# EAGLE design Communications Board (EAGLE 6.6.0)

## Sheet 1 of 3
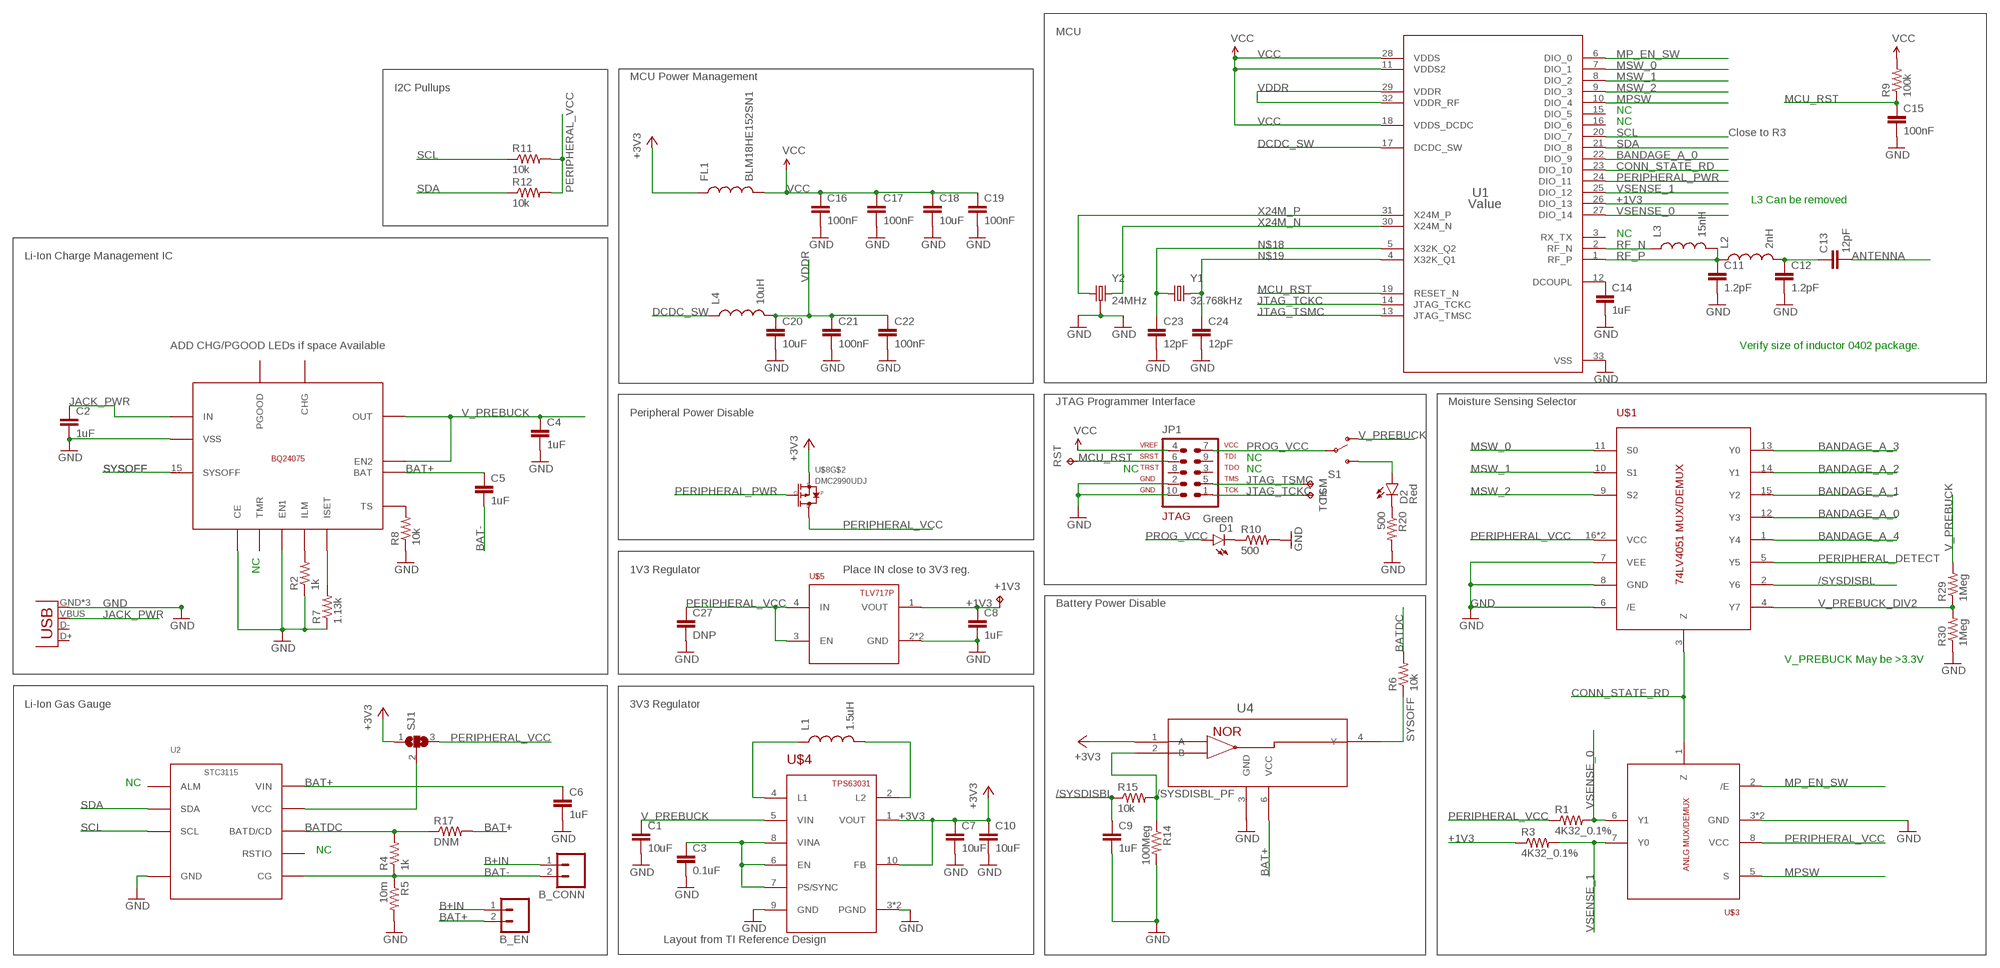
[diagram p0: schematic, sheet 1]

### Parts
+1V3  TPTP10R  [TP10R]
B_CONN  M02PTH  [1X02]
B_EN  M02PTH  [1X02]
C1  10uF  CAP0402-CAP  [0402-CAP]
C2  1uF  CAP0603-CAP  [0603-CAP]
C3  0.1uF  CAP0402-CAP  [0402-CAP]
C4  1uF  CAP0603-CAP  [0603-CAP]
C5  1uF  CAP0603-CAP  [0603-CAP]
C6  1uF  CAP0603-CAP  [0603-CAP]
C7  10uF  CAP0402-CAP  [0402-CAP]
C8  1uF  CAP0402-CAP  [0402-CAP]
C9  1uF  CAP0603-CAP  [0603-CAP]
C10  10uF  CAP0603-CAP  [0603-CAP]
C11  1.2pF  CAP0402-CAP  [0402-CAP]
C12  1.2pF  CAP0402-CAP  [0402-CAP]
C13  12pF  CAP0402-CAP  [0402-CAP]
C14  1uF  CAP0402-CAP  [0402-CAP]
C15  100nF  CAP0402-CAP  [0402-CAP]
C16  100nF  CAP0402-CAP  [0402-CAP]
C17  100nF  CAP0402-CAP  [0402-CAP]
C18  10uF  CAP0402-CAP  [0402-CAP]
C19  100nF  CAP0402-CAP  [0402-CAP]
C20  10uF  CAP0402-CAP  [0402-CAP]
C21  100nF  CAP0402-CAP  [0402-CAP]
C22  100nF  CAP0402-CAP  [0402-CAP]
C23  12pF  CAP0402-CAP  [0402-CAP]
C24  12pF  CAP0402-CAP  [0402-CAP]
C27  DNP  CAP0402-CAP  [0402-CAP]
D1  Green  LED1206  [LED-1206]
D2  Red  LED1206  [LED-1206]
FL1  BLM18HE152SN1  INDUCTOR0603  [0603]
JP1  AVR-JTAG-10  [AVR-JTAG-10]
L1  1.5uH  INDUCTOR  [IND1212]
L2  2nH  INDUCTOR0402  [C0402]
L3  15nH  INDUCTOR0402  [C0402]
L4  10uH  INDUCTOR0603  [0603]
R1  4K32_0.1%  RESISTOR0402-RES  [0402-RES]
R2  1k  RESISTOR0603-RES  [0603-RES]
R3  4K32_0.1%  RESISTOR0402-RES  [0402-RES]
R4  1k  RESISTOR0603-RES  [0603-RES]
R5  10m  RESISTOR0603-RES  [0603-RES]
R6  10k  RESISTOR0603-RES  [0603-RES]
R7  1.13k  RESISTOR0603-RES  [0603-RES]
R8  10k  RESISTOR0603-RES  [0603-RES]
R9  100k  RESISTOR0603-RES  [0603-RES]
R10  500  RESISTOR0603-RES  [0603-RES]
R11  10k  RESISTOR0603-RES  [0603-RES]
R12  10k  RESISTOR0603-RES  [0603-RES]
R14  100Meg  RESISTOR0603-RES  [0603-RES]
R15  10k  RESISTOR0603-RES  [0603-RES]
R17  DNM  RESISTOR0603-RES  [0603-RES]
R20  500  RESISTOR0603-RES  [0603-RES]
R29  1Meg  RESISTOR0402-RES  [0402-RES]
R30  1Meg  RESISTOR0402-RES  [0402-RES]
RST  TPTP10R  [TP10R]
S1  SWITCH-SPDT  [JS102011SAQN]
SJ1  SJ2W  [SJ_2]
TCK  TPTP10R  [TP10R]
TSM  TPTP10R  [TP10R]
U1  Value  CC2640F128RHBR  [RHB0032E]
U2  STC3115  [DFN10-2X3]
U4  SN74AUP1G02_DSF_6  [DSF6]
U$1  74LV4051  [SOT763-1]
U$2  BQ24075  [QFN16-3X3MM]
U$3  74LVC2G53  [SOT833-1]
U$4  TPS63031  [SON-10]
U$5  TLV717P  [X2SON]
U$8  DMC2990UDJ  [SOT963]
X2  USB-MICROB  [USB-MICROB]
Y1  32.768kHz  CRYSTAL  [CRYSTAL-3.2X1.5]
Y2  24MHz  CRYSTAL-GROUNDED  [TSX-3225]

### Nets
+1V3: +1V3.TP C8.1 R3.1 U1.26(DIO_13) U$5.1(VOUT)
+3V3: C7.1 C10.1 FL1.1 SJ1.1 U4.1(A) U$4.1(VOUT) U$4.10(FB) U$8.4(S) ; also sheet 2,3
/SYSDISBL: C9.1 R15.1 U$1.2(Y6) ; also sheet 3
/SYSDISBL_PF: R14.1 R15.2 U4.2(B)
ANTENNA: C13.2
B+IN: B_CONN.1 B_EN.1
BANDAGE_A_0: U1.22(DIO_9) U$1.12(Y3) ; also sheet 3
BANDAGE_A_1: U$1.15(Y2) ; also sheet 3
BANDAGE_A_2: U$1.14(Y1) ; also sheet 3
BANDAGE_A_3: U$1.13(Y0) ; also sheet 3
BANDAGE_A_4: U$1.1(Y4) ; also sheet 3
BAT+: B_EN.2 C5.1 C6.1 R17.2 U2.P10(VIN) U4.6(VCC) U$2.2(BAT) U$2.3(BAT)
BAT-: B_CONN.2 C5.2 R4.1 R5.1 U2.P6(CG)
BATDC: R4.2 R6.2 R17.1 U2.P8(BATD/CD)
CONN_STATE_RD: U1.23(DIO_10) U$1.3(Z) U$3.1(Z)
DCDC_SW: L4.1 U1.17(DCDC_SW)
GND: C1.2 C2.2 C3.2 C4.2 C6.2 C7.2 C8.2 C9.2 C10.2 C11.2 C12.2 C14.2 C15.2 C16.2 C17.2 C18.2 C19.2 C20.2 C21.2 C22.2 C23.2 C24.2 C27.2 JP1.2 JP1.10 R2.1 R5.2 R7.1 R8.1 R10.2 R14.2 R20.2 R30.1 U1.33(VSS) U2.P5(GND) U4.3(GND) U$1.6(/E) U$1.7(VEE) U$1.8(GND) U$2.4(CE) U$2.6(EN1) U$2.8(VSS) U$2.EXT(VSS) U$3.3(GND) U$3.4(GND) U$4.3(PGND) U$4.9(GND) U$4.PAD(PGND) U$5.2(GND) U$5.PAD(GND) X2.GND X2.MT1(GND) X2.MT2(GND) Y2.2 Y2.4 ; also sheet 2,3
JACK_PWR: C2.1 U$2.13(IN) X2.VBUS
JTAG_TCKC: JP1.1 TCK.TP U1.14(JTAG_TCKC)
JTAG_TSMC: JP1.5 TSM.TP U1.13(JTAG_TMSC)
MCU_RST: C15.1 JP1.6 R9.1 RST.TP U1.19(RESET_N)
MP_EN_SW: U1.6(DIO_0) U$3.2(/E)
MPSW: U1.10(DIO_4) U$3.5(S)
MSW_0: U1.7(DIO_1) U$1.11(S0)
MSW_1: U1.8(DIO_2) U$1.10(S1)
MSW_2: U1.9(DIO_3) U$1.9(S2)
N$5: L1.P$1 U$4.4(L1)
N$6: D2.A S1.3(S)
N$8: L1.P$2 U$4.2(L2)
N$10: C3.1 U$4.6(EN) U$4.7(PS/SYNC) U$4.8(VINA)
N$16: D2.C R20.1
N$18: C23.1 U1.5(X32K_Q2) Y1.1
N$19: C24.1 U1.4(X32K_Q1) Y1.2
N$20: R8.2 U$2.1(TS)
N$23: R2.2 U$2.12(ILM)
N$24: R7.2 U$2.16(ISET)
N$26: SJ1.2 U2.P9(VCC)
N$27: D1.C R10.1
N$41: C12.1 C13.1 L2.2
N$43: C14.1 U1.12(DCOUPL)
PERIPHERAL_DETECT: U$1.5(Y5) ; also sheet 3
PERIPHERAL_PWR: U1.24(DIO_11) U$8.5(G)
PERIPHERAL_VCC: C27.1 R1.1 R11.2 R12.2 SJ1.3 U$1.16(VCC) U$1.PAD(VCC) U$3.8(VCC) U$5.3(EN) U$5.4(IN) U$8.3(D) ; also sheet 3
PROG_VCC: D1.A JP1.7 S1.2(P)
RF_N: L3.1 U1.2(RF_N)
RF_P: C11.1 L2.1 L3.2 U1.1(RF_P)
SCL: R11.1 U1.20(DIO_7) U2.P3(SCL) ; also sheet 2,3
SDA: R12.1 U1.21(DIO_8) U2.P2(SDA) ; also sheet 2,3
SYSOFF: R6.1 U4.4(Y) U$2.15(SYSOFF)
V_PREBUCK: C1.1 C4.1 R29.2 S1.1(O) U$2.5(EN2) U$2.10(OUT) U$2.11(OUT) U$4.5(VIN) ; also sheet 3
V_PREBUCK_DIV2: R29.1 R30.2 U$1.4(Y7)
VCC: C16.1 C17.1 C18.1 C19.1 FL1.2 JP1.4 R9.2 U1.11(VDDS2) U1.18(VDDS_DCDC) U1.28(VDDS) ; also sheet 2
VDDR: C20.1 C21.1 C22.1 L4.2 U1.29(VDDR) U1.32(VDDR_RF)
VSENSE_0: R1.2 U1.27(DIO_14) U$3.6(Y1)
VSENSE_1: R3.2 U1.25(DIO_12) U$3.7(Y0)
X24M_N: U1.30(X24M_N) Y2.3
X24M_P: U1.31(X24M_P) Y2.1
Unconnected: JP1.3 JP1.8 JP1.9 U1.3(RX_TX) U1.15(DIO_5) U1.16(DIO_6) U2.P1(ALM) U2.P7(RSTIO) U$2.7(PGOOD) U$2.9(CHG) U$2.14(TMR) U$8.1(S) U$8.2(G) U$8.6(D) X2.D+ X2.D-

### Notes on the sheet
- MCU
- MCU Power Management
- I2C Pullups
- NC
- NC
- Close to R3
- L3 Can be removed
- NC
- Li-Ion Charge Management IC
- ADD CHG/PGOOD LEDs if space Available | Verify size of inductor 0402 package.
- JTAG Programmer Interface | Moisture Sensing Selector
- Peripheral Power Disable
- NC
- NC | NC
- NC | 1V3 Regulator | Place IN close to 3V3 reg.
- Battery Power Disable
- V_PREBUCK May be >3.3V
- Li-Ion Gas Gauge | 3V3 Regulator
- NC
- NC
- Layout from TI Reference Design

## Sheet 2 of 3
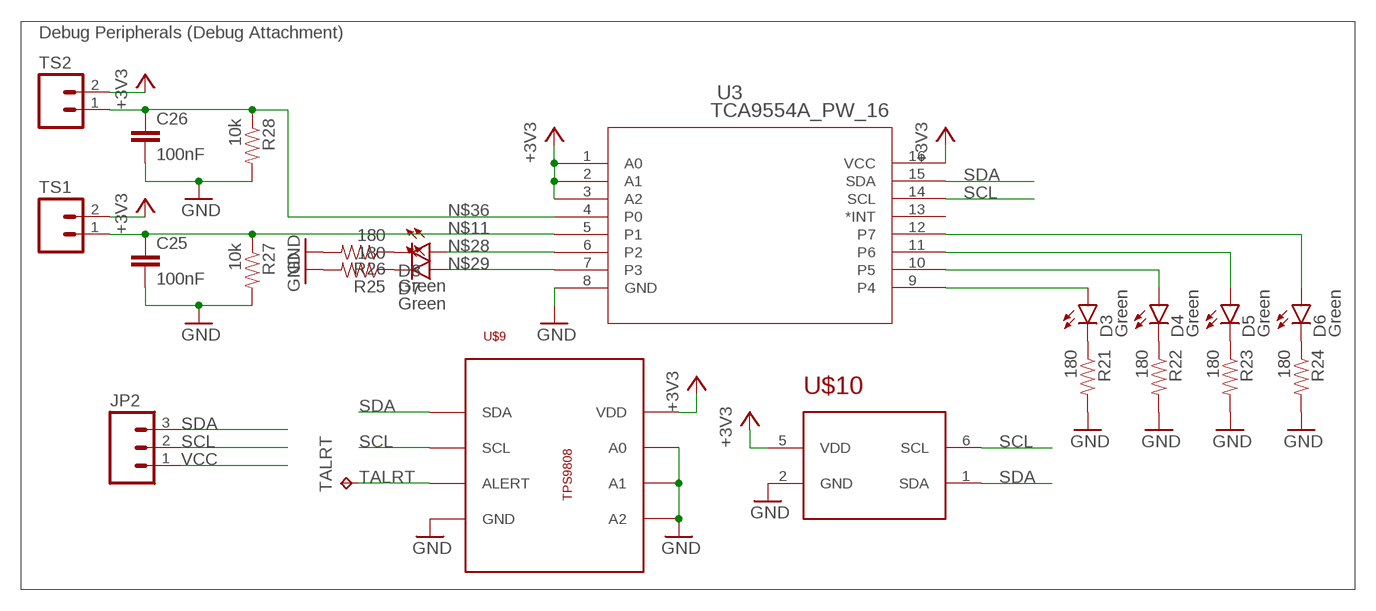
[diagram p1: schematic, sheet 2]

### Parts
C25  100nF  CAP0402-CAP  [0402-CAP]
C26  100nF  CAP0402-CAP  [0402-CAP]
D3  Green  LED1206  [LED-1206]
D4  Green  LED1206  [LED-1206]
D5  Green  LED1206  [LED-1206]
D6  Green  LED1206  [LED-1206]
D7  Green  LED1206  [LED-1206]
D8  Green  LED1206  [LED-1206]
JP2  M03PTH  [1X03]
R21  180  RESISTOR0603-RES  [0603-RES]
R22  180  RESISTOR0603-RES  [0603-RES]
R23  180  RESISTOR0603-RES  [0603-RES]
R24  180  RESISTOR0603-RES  [0603-RES]
R25  180  RESISTOR0603-RES  [0603-RES]
R26  180  RESISTOR0603-RES  [0603-RES]
R27  10k  RESISTOR0603-RES  [0603-RES]
R28  10k  RESISTOR0603-RES  [0603-RES]
TALRT  TPTP17R  [TP17R]
TS1  M02PTH  [1X02]
TS2  M02PTH  [1X02]
U3  TCA9554A_PW_16  [PW16]
U$9  MCP9808  [MSOP8]
U$10  HDC1050  [SON-6]

### Nets
+3V3: TS1.2 TS2.2 U3.1(A0) U3.2(A1) U3.3(A2) U3.16(VCC) U$9.8(VDD) U$10.5(VDD) ; also sheet 1,3
GND: C25.2 C26.2 R21.2 R22.2 R23.2 R24.2 R25.2 R26.2 R27.2 R28.2 U3.8(GND) U$9.4(GND) U$9.5(A2) U$9.6(A1) U$9.7(A0) U$10.2(GND) ; also sheet 1,3
N$7: D3.A U3.9(P4)
N$11: C25.1 R27.1 TS1.1 U3.5(P1)
N$13: D4.A U3.10(P5)
N$15: D5.A U3.11(P6)
N$17: D6.A U3.12(P7)
N$28: D8.A U3.6(P2)
N$29: D7.A U3.7(P3)
N$30: D3.C R21.1
N$31: D4.C R22.1
N$32: D5.C R23.1
N$33: D6.C R24.1
N$34: D7.C R25.1
N$35: D8.C R26.1
N$36: C26.1 R28.1 TS2.1 U3.4(P0)
SCL: JP2.2 U3.14(SCL) U$9.2(SCL) U$10.6(SCL) ; also sheet 1,3
SDA: JP2.3 U3.15(SDA) U$9.1(SDA) U$10.1(SDA) ; also sheet 1,3
TALRT: TALRT.TP U$9.3(ALERT)
VCC: JP2.1 ; also sheet 1
Unconnected: U3.13(*INT)

### Notes on the sheet
- Debug Peripherals (Debug Attachment)

## Sheet 3 of 3
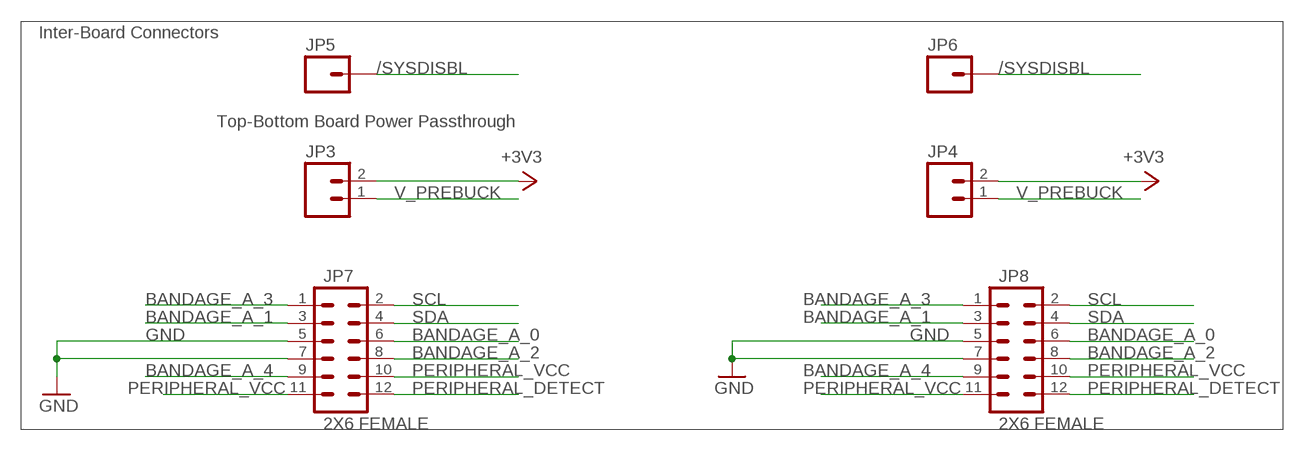
[diagram p2: schematic, sheet 3]

### Parts
JP3  M021X02_NO_SILK  [1X02_NO_SILK]
JP4  M021X02_NO_SILK  [1X02_NO_SILK]
JP5  M01PTH  [1X01]
JP6  M01PTH  [1X01]
JP7  2X6 FEMALE  M06X2PTH_FEMALE  [2X6]
JP8  2X6 FEMALE  M06X2PTH_FEMALE  [2X6]

### Nets
+3V3: JP3.2 JP4.2 ; also sheet 1,2
/SYSDISBL: JP5.1 JP6.1 ; also sheet 1
BANDAGE_A_0: JP7.6 JP8.6 ; also sheet 1
BANDAGE_A_1: JP7.3 JP8.3 ; also sheet 1
BANDAGE_A_2: JP7.8 JP8.8 ; also sheet 1
BANDAGE_A_3: JP7.1 JP8.1 ; also sheet 1
BANDAGE_A_4: JP7.9 JP8.9 ; also sheet 1
GND: JP7.5 JP7.7 JP8.5 JP8.7 ; also sheet 1,2
PERIPHERAL_DETECT: JP7.12 JP8.12 ; also sheet 1
PERIPHERAL_VCC: JP7.10 JP7.11 JP8.10 JP8.11 ; also sheet 1
SCL: JP7.2 JP8.2 ; also sheet 1,2
SDA: JP7.4 JP8.4 ; also sheet 1,2
V_PREBUCK: JP3.1 JP4.1 ; also sheet 1

### Notes on the sheet
- Inter-Board Connectors
- Top-Bottom Board Power Passthrough

## Library data of the parts
+1V3 RST TALRT TCK TSM = testpad:TP: Test pad
B_CONN B_EN JP3 JP4 TS1 TS2 = SparkFun-Connectors:M02: Standard 2-pin 0.1" header. Use with - straight break away headers ( PRT-00116) - right angle break away headers (PRT-00553) - swiss pins (PRT-00743) - machine pins (PRT-00117) - female headers (PRT-00115) Molex polarized connector foot print use with: PRT-08233 with associated crimp pins and housings. 2.54_SCREWTERM for use with PRT-10571. 3.5mm Screw Terminal footprints for PRT-08084 5mm Screw Terminal footprints for use with PRT-08432
C1 C3 C7-C27 = SparkFun-Passives:CAP: Capacitor Standard 0603 ceramic capacitor, and 0.1" leaded capacitor.
C2 C4-C6 = SparkFun:CAP: Capacitor Standard 0603 ceramic capacitor, and 0.1" leaded capacitor.
D1-D8 = SparkFun-LED:LED: LEDs Standard schematic elements and footprints for 5mm, 3mm, 1206, and 0603 sized LEDs. 5mm - Spark Fun Electronics SKU : COM-00529 (and others)
FL1 L4 = Michael Blouin Library:INDUCTOR: Inductors
JP1 = avr-7:AVR-JTAG-10: AVR JTAG Debug/Programming Header
JP2 = SparkFun-Connectors:M03: Header 3 Standard 3-pin 0.1" header. Use with straight break away headers (SKU : PRT-00116), right angle break away headers (PRT-00553), swiss pins (PRT-00743), machine pins (PRT-00117), and female headers (PRT-00115). Molex polarized connector foot print use with SKU : PRT-08232 with associated crimp pins and housings.
JP5 JP6 = SparkFun-Connectors:M01: Header 1 Standard 1-pin 0.1" header. Use with straight break away headers (SKU : PRT-00116), right angle break away headers (PRT-00553), swiss pins (PRT-00743), machine pins (PRT-00117), and female headers (PRT-00115).
JP7 JP8 = SparkFun-Connectors:M06X2; PROD_ID: CONN-12423
L1 = Capstone Library:INDUCTOR: Inductors
L2 L3 = SparkFun-Passives:INDUCTOR: Inductors
R1-R12 R14 R15 R17 R20-R30 = SparkFun-Passives:RESISTOR: Resistor Basic schematic elements and footprints for 0603, 1206, and PTH resistors.
S1 = Capstone Library:SWITCH-SPDT: SPDT Switch Simple slide switch for C&K Components JS102011SAQN DIGIKEY PN: 401-1999-2-ND Symbol from Sparkfun Libs
SJ1 = jumper:SJ2W: SMD solder JUMPER
U1 = Capstone Library:CC2640F128RHBR; ALTERNATEPARTNUMBER: CC2640F128RHBT; COMPTYPE: IC; MANUFACTURER: Texas Instruments; MOUNTTYPE: SMT; PACKAGEREFERENCE: RHB0032E; PARTNUMBER: CC2640F128RHBR; PIN_COUNT: 33; REFDES: RefDes; ROHS: Y; TYPE: TYPE
U2 = Michael Blouin Library:STC3115: STC3115 Li-Ion Gas gauge IC with alarm output for handheld applications
U3 = Capstone Library:TCA9554A_PW_16; DATASHEETURL: http://www.ti.com/lit/gpn/TCA9554A; DESCRIPTION: Remote 8-Bit I2C and SMBus I/O Expander; FAMILY_NAME: I2C IO EXPANDER; GENERIC_PART_NUMBER: TCA9554A; INDUSTRY_STD_PKG_TYPE: TSSOP; MANUFACTURER: Texas Instruments; MANUFACTURER_PART_NUMBER: tca9554a_pw_16; PACKAGE_DESIGNATOR: PW; PIN_COUNT: 16; VENDOR: Texas Instruments
U4 = Capstone Library:SN74AUP1G02_DSF_6; DATASHEETURL: http://www.ti.com/lit/gpn/SN74AUP1G02; DESCRIPTION: Low-Power Single 2-Input Positive-NOR Gate; FAMILY_NAME: LL NOR GATE; GENERIC_PART_NUMBER: SN74AUP1G02; INDUSTRY_STD_PKG_TYPE: SON; MANUFACTURER: Texas Instruments; MANUFACTURER_PART_NUMBER: sn74aup1g02_dsf_6; PACKAGE_DESIGNATOR: DSF; PIN_COUNT: 6; VENDOR: Texas Instruments
U$1 = Capstone Library:74LV4051
U$2 = CM Module Library:BQ24075
U$3 = Capstone Library:74LVC2G53
U$4 = Capstone Library:TPS63031
U$5 = Capstone Library:TLV717P
U$8 = Capstone Library:DMC2990UDJ: Diodes Incorporated DMC2990UDJ Complementary Pair Enhancement Mode MOSFET
U$9 = Capstone Library:MCP9808: MCP9808 Maximum Accuracy Digital Temperature Sensor
U$10 = Capstone Library:HDC1050
X2 = Capstone Library:USB: USB Connectors USB-B-PTH is fully proven SKU : PRT-00139 USB-miniB is fully proven SKU : PRT-00587 USB-A-PCB is untested. USB-A-H is throughly reviewed, but untested. Spark Fun Electronics SKU : PRT-00437 USB-B-SMT is throughly reviewed, but untested. Needs silkscreen touching up. USB-A-S has not been used/tested USB-MB-H has not been used/tested
Y1 = Capstone Library:CRYSTAL
Y2 = Capstone Library:CRYSTAL-GROUNDED

## Board
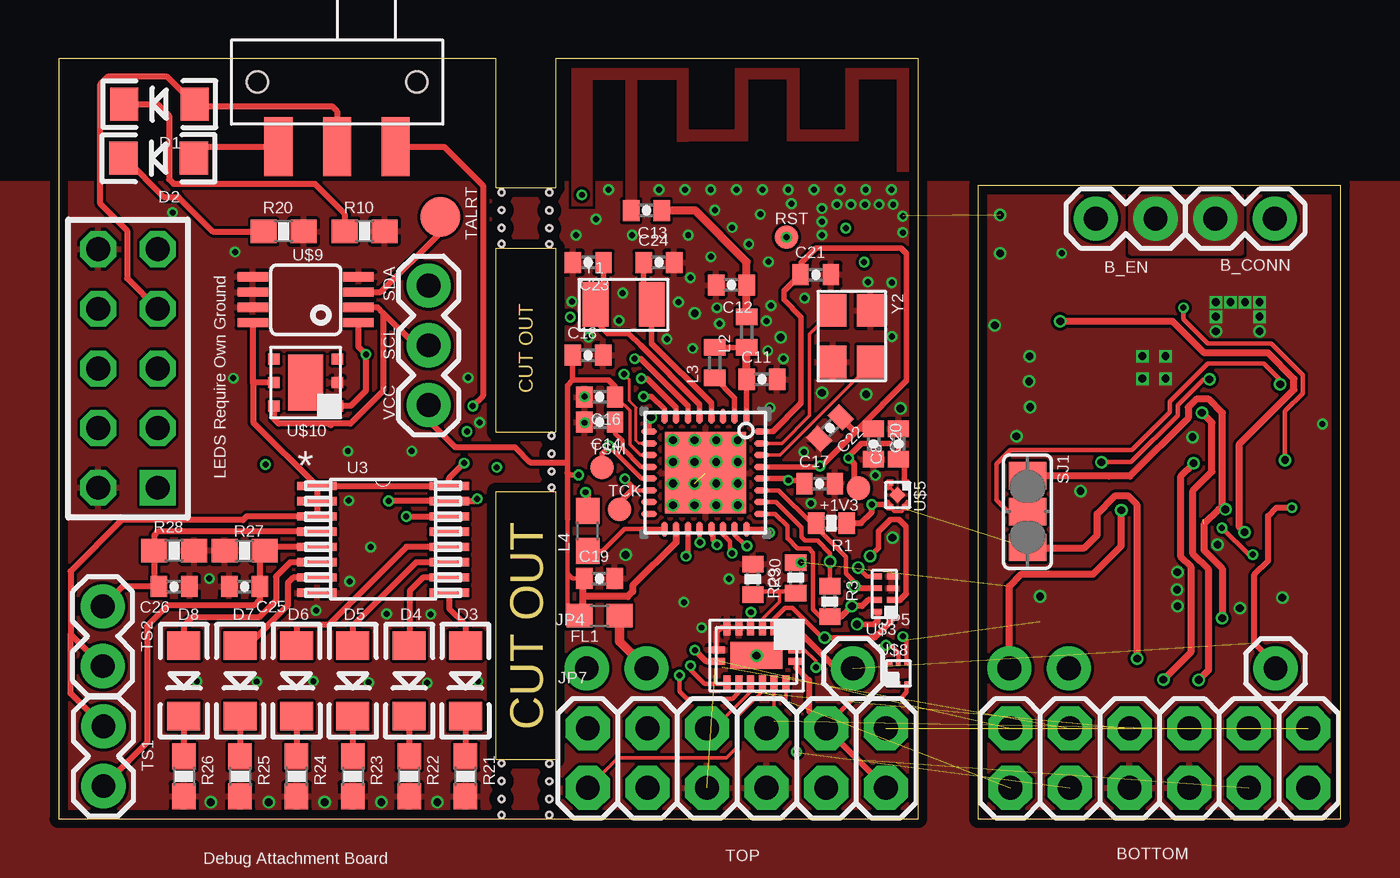
[diagram p3: board, top side]
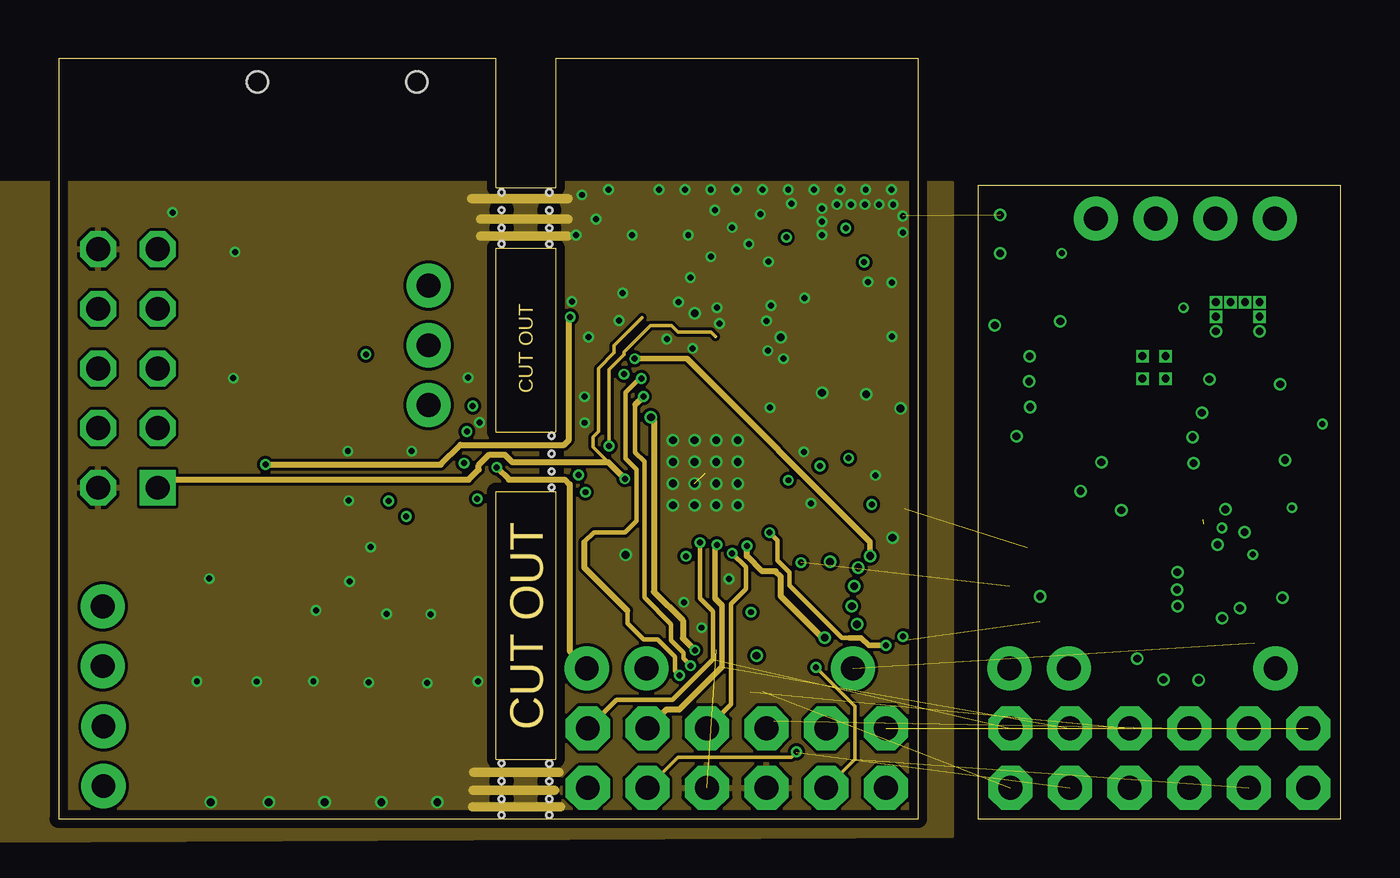
[diagram p4: board, inner layer Route2]
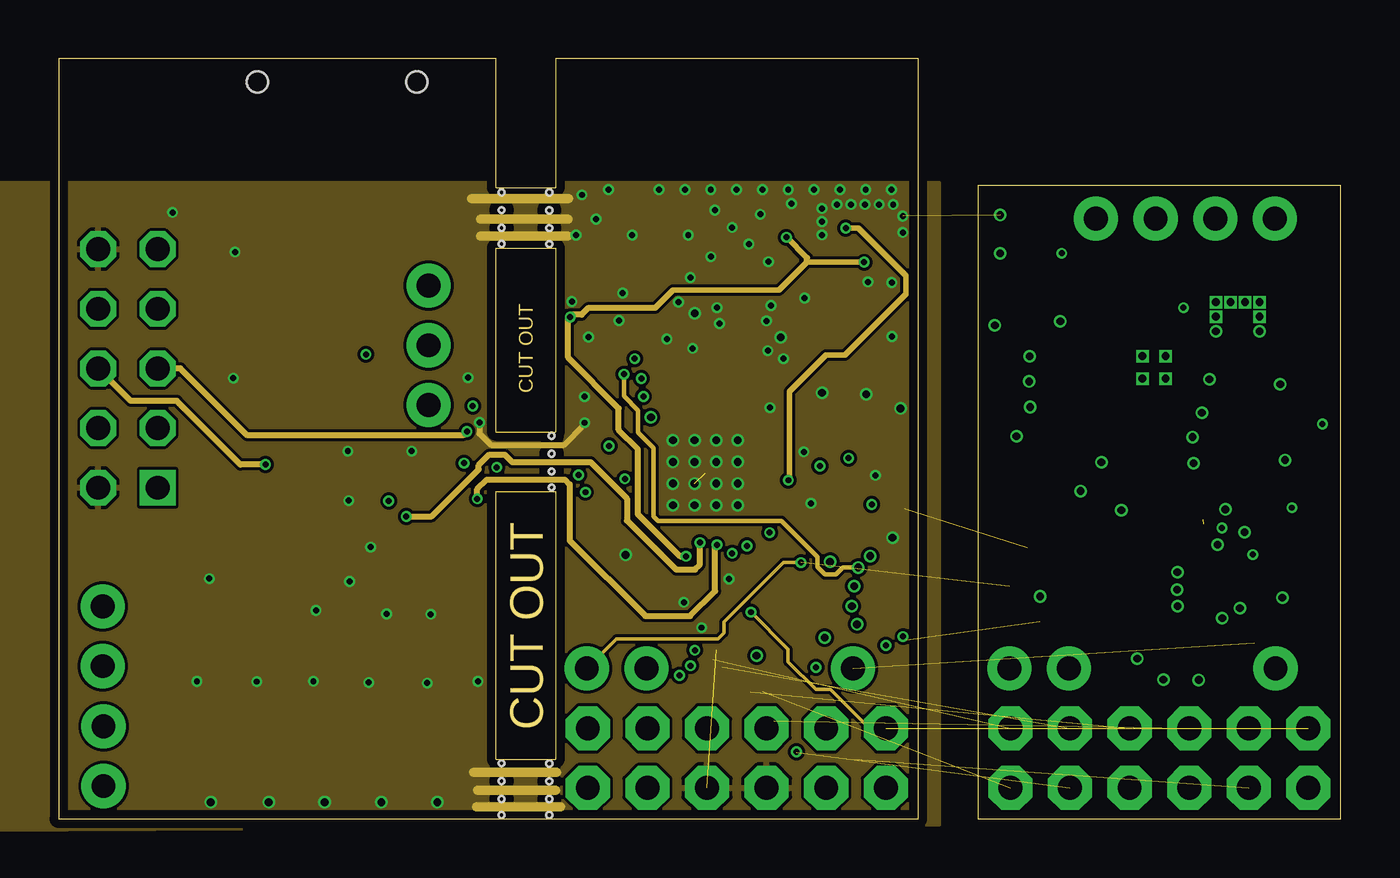
[diagram p5: board, inner layer Route15]
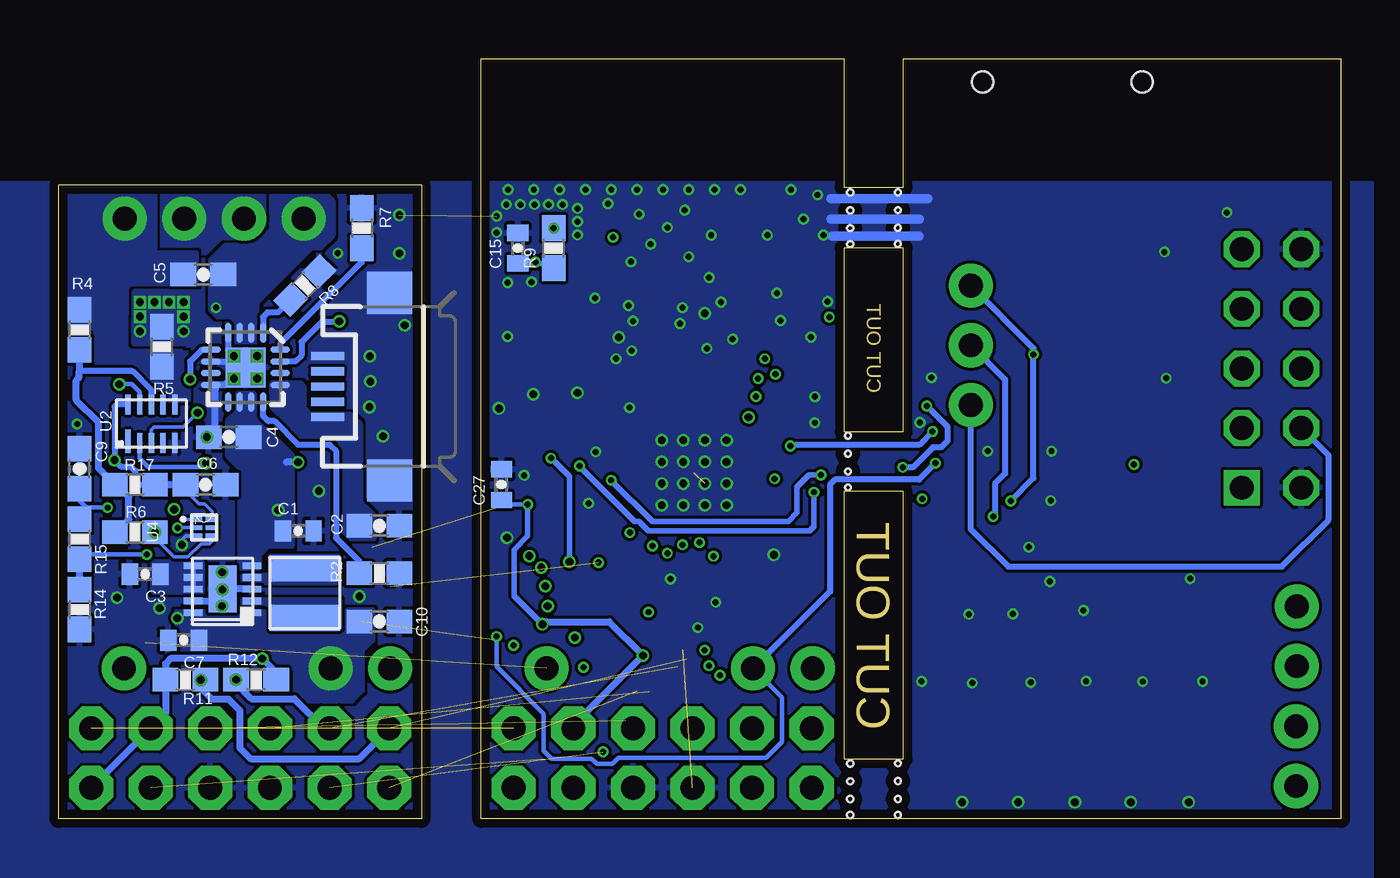
[diagram p6: board, bottom side, seen from below]

Size 54.62 x 32.39 mm. Coordinates in mm from the lower left corner, seen from the top.
Outline: 36.62,0 36.62,32.39 21.17,32.39 21.17,26.9 18.63,26.9 18.63,32.39 0,32.39 0,0 36.62,0
Outline: 21.17,24.33 21.17,16.49 18.63,16.49 18.63,24.33 21.17,24.33
Outline: 21.17,13.95 21.17,2.54 18.63,2.54 18.63,13.95 21.17,13.95
Outline: 39.17,0 54.62,0 54.62,27 39.17,27 39.17,0
Copper layers (1*2*15*16): Top 0.035559375mm / dielectric 0.17018125mm / Route2 0.01778125mm / dielectric 47mil / Route15 0.01778125mm / dielectric 0.17018125mm / Bottom 0.035559375mm
Design rules "OSH Park 4 Layer *": minimum track width 5mil, minimum drill 10mil, track to track 5mil, track to pad 6mil, pad to pad 6mil, via to via 6mil, smd to smd 0mil, copper to edge 15mil, drill to drill 8mil, minimum pad ring 6mil, minimum via ring 4mil, stop-mask expansion 4mil, vias tented up to drill 100mil, thermal gap 6mil
Holes 0.25 mm at 21,16.32 21,15.56 21,14.8 21,14.12 20.9,2.36 20.9,1.6 20.9,0.84 20.9,0.16 18.87,2.37 18.87,1.61 18.87,0.85 18.87,0.17 20.9,26.69 20.9,25.93 20.9,25.17 20.9,24.49 18.87,26.7 18.87,25.94 18.87,25.18 18.87,24.5

### Footprints (pad centres in the part's own frame; a part is rotated, then mirrored left to right if it is on the bottom)
TP10R = smd 1 x 1: TP 0,0
1X02 = drill 1.016 pad 1.88: 1 0,0; 2 2.54,0
0402-CAP = smd 0.7 x 0.9: 1 -0.65,0; 2 0.65,0
0603-CAP = smd 1.1 x 1: 1 -0.85,0; 2 0.85,0
LED-1206 = smd 1.2 x 1.4: A -1.5,0; C 1.5,0
0603 = smd 1.1 x 1: 1 -0.85,0; 2 0.85,0
AVR-JTAG-10 = drill 1.016 square: 1 -5.08,-1.27 | drill 1.016 octagon: 2 -5.08,1.27; 3 -2.54,-1.27; 4 -2.54,1.27; 5 0,-1.27; 6 0,1.27; 7 2.54,-1.27; 8 2.54,1.27; 9 5.08,-1.27; 10 5.08,1.27
1X03 = drill 1.016 pad 1.88: 1 0,0; 2 2.54,0; 3 5.08,0
1X02_NO_SILK = drill 1.016 pad 1.88: 1 0,0; 2 2.54,0
1X01 = drill 1.016 pad 1.88: 1 0,0
2X6 = drill 1.016 pad 1.88 octagon: 1 0,0; 2 0,2.54; 3 2.54,0; 4 2.54,2.54; 5 5.08,0; 6 5.08,2.54; 7 7.62,0; 8 7.62,2.54; 9 10.16,0; 10 10.16,2.54; 11 12.7,0; 12 12.7,2.54
IND1212 = smd 1.1 x 3: P$1 -1.05,0; P$2 1.05,0
C0402 = smd 0.7 x 0.9: 1 -0.65,0; 2 0.65,0
0402-RES = smd 0.7 x 0.9: 1 -0.65,0; 2 0.65,0
0603-RES = smd 1.1 x 1: 1 -0.85,0; 2 0.85,0
JS102011SAQN = smd 1.2 x 2.5: 1 -2.5,2.75; 2 0,2.75; 3 2.5,2.75 | hole 0.9: -3.4,0; 3.4,0
SJ_2 = smd 1.168 x 1.6: 1 -1.524,0; 2 0,0; 3 1.524,0
TP17R = smd 1.7 x 1.7: TP 0,0
RHB0032E = smd 0.65 x 0.28: 1 -2.4,1.75; 2 -2.4,1.25; 3 -2.4,0.75; 4 -2.4,0.25; 5 -2.4,-0.25; 6 -2.4,-0.75; 7 -2.4,-1.25; 8 -2.4,-1.75; 17 2.4,-1.75; 18 2.4,-1.25; 19 2.4,-0.75; 20 2.4,-0.25; 21 2.4,0.25; 22 2.4,0.75; 23 2.4,1.25; 24 2.4,1.75 | smd 0.28 x 0.65: 9 -1.75,-2.4; 10 -1.25,-2.4; 11 -0.75,-2.4; 12 -0.25,-2.4; 13 0.25,-2.4; 14 0.75,-2.4; 15 1.25,-2.4; 16 1.75,-2.4; 25 1.75,2.4; 26 1.25,2.4; 27 0.75,2.4; 28 0.25,2.4; 29 -0.25,2.4; 30 -0.75,2.4; 31 -1.25,2.4; 32 -1.75,2.4 | smd 3.454 x 3.454: 33 0,0
DFN10-2X3 = smd 0.23 x 1: P1 -1,-0.75 | smd 0.23 x 0.85: P2 -0.5,-0.825; P3 0,-0.825; P4 0.5,-0.825; P5 1,-0.825; P6 1,0.825; P7 0.5,0.825; P8 0,0.825; P9 -0.5,0.825; P10 -1,0.825
PW16 = smd 1.676 x 0.356: 1 -2.819,2.275; 2 -2.819,1.625; 3 -2.819,0.975; 4 -2.819,0.325; 5 -2.819,-0.325; 6 -2.819,-0.975; 7 -2.819,-1.625; 8 -2.819,-2.275; 9 2.819,-2.275; 10 2.819,-1.625; 11 2.819,-0.975; 12 2.819,-0.325; 13 2.819,0.325; 14 2.819,0.975; 15 2.819,1.625; 16 2.819,2.275
DSF6 = smd 0.508 x 0.198: 1 -0.335,0.35; 2 -0.335,0; 3 -0.335,-0.35; 4 0.335,-0.35; 5 0.335,0; 6 0.335,0.35
SOT763-1 = smd 0.7 x 0.3: 1 -1.7,-0.25; 8 1.7,-0.25; 9 1.7,0.25; 16 -1.7,0.25 | smd 0.3 x 0.7: 2 -1.25,-1.2; 3 -0.75,-1.2; 4 -0.25,-1.2; 5 0.25,-1.2; 6 0.75,-1.2; 7 1.25,-1.2; 10 1.25,1.2; 11 0.75,1.2; 12 0.25,1.2; 13 -0.25,1.2; 14 -0.75,1.2; 15 -1.25,1.2 | smd 2.2 x 1.15: PAD 0,0
QFN16-3X3MM = smd 0.85 x 0.28: 1 -1.475,0.75; 2 -1.475,0.25; 3 -1.475,-0.25; 4 -1.475,-0.75; 9 1.475,-0.75; 10 1.475,-0.25; 11 1.475,0.25; 12 1.475,0.75 | smd 0.28 x 0.85: 5 -0.75,-1.475; 6 -0.25,-1.475; 7 0.25,-1.475; 8 0.75,-1.475; 13 0.75,1.475; 14 0.25,1.475; 15 -0.25,1.475; 16 -0.75,1.475 | smd 1.7 x 1.7: EXT 0,0
SOT833-1 = smd 0.25 x 0.4: 1 -0.75,-0.3; 2 -0.25,-0.3; 3 0.25,-0.3; 4 0.75,-0.3; 5 0.75,0.3; 6 0.25,0.3; 7 -0.25,0.3; 8 -0.75,0.3
SON-10 = smd 0.28 x 0.8: 1 -1,-1.25; 2 -0.5,-1.25; 3 0,-1.25; 4 0.5,-1.25; 5 1,-1.25; 6 1,1.25; 7 0.5,1.25; 8 0,1.25; 9 -0.5,1.25; 10 -1,1.25 | smd 2 x 1.2: PAD 0,0
X2SON = smd 0.15 x 0.15: 1 -0.5,0.3; 2 -0.5,-0.3; 3 0.5,-0.3; 4 0.5,0.3 | smd 0.48 x 0.48 rotated 45: PAD 0,0
SOT963 = smd 0.19 x 0.2: 1 -0.35,-0.45; 2 0,-0.45; 3 0.35,-0.45; 4 0.35,0.45; 5 0,0.45; 6 -0.35,0.45
MSOP8 = smd 0.4 x 1.3: 1 -0.975,-2.25; 2 -0.325,-2.25; 3 0.325,-2.25; 4 0.975,-2.25; 5 0.975,2.25; 6 0.325,2.25; 7 -0.325,2.25; 8 -0.975,2.25
SON-6 = smd 0.45 x 0.5: 1 -1,-1.35; 2 0,-1.35; 3 1,-1.35; 4 1,1.35; 5 0,1.35; 6 -1,1.35 | smd 2.4 x 1.5: PAD 0,0
USB-MICROB = smd 0.35 x 1.4: D+ 0,2.65; D- -0.65,2.65; GND 1.3,2.65; ID 0.65,2.65; VBUS -1.3,2.65 | smd 1.8 x 1.9: MT1 -4,0; MT2 4,0
CRYSTAL-3.2X1.5 = smd 1.1 x 1.9: 1 -1.2,0; 2 1.2,0
TSX-3225 = smd 1.4 x 1.15: 1 -1.1,-0.8; 2 1.1,-0.8; 3 1.1,0.8; 4 -1.1,0.8

### Placement (x,y rotation side)
+1V3  34.08,14.09 0 top
B_CONN  49.27,25.58 0 top
B_EN  46.73,25.58 180 top
C1  44.41,12.27 0 bottom
C2  40.96,12.49 0 bottom
C3  50.94,10.43 180 bottom
C4  47.37,16.27 180 bottom
C5  48.46,23.2 180 bottom
C6  48.36,14.24 0 bottom
C7  49.3,7.61 180 bottom
C8  35.78,15.98 90 top
C9  53.73,14.92 90 bottom
C10  40.96,8.41 0 bottom
C11  29.96,18.73 0 top
C12  28.66,22.75 180 top
C13  25.04,25.92 180 top
C14  23.05,16.91 180 top
C15  35.06,24.32 90 bottom
C16  23.05,17.98 180 top
C17  32.42,14.28 0 top
C18  22.55,19.76 0 top
C19  23.04,10.24 0 top
C20  34.71,15.97 270 top
C21  32.25,23.19 0 top
C22  32.85,16.65 225 top
C23  22.56,23.71 180 top
C24  25.57,23.71 0 top
C25  7.92,9.9 180 top
C26  4.92,9.9 0 top
C27  35.76,14.24 90 bottom
D1  4.29,30.45 180 top
D2  4.26,28.15 180 top
D3  17.33,5.88 270 top
D4  14.93,5.88 270 top
D5  12.53,5.88 270 top
D6  10.13,5.88 270 top
D7  7.73,5.88 270 top
D8  5.33,5.88 270 top
FL1  23.04,8.66 180 top
JP1  2.95,19.19 90 top
JP2  15.76,17.64 90 top
JP3  40.5,6.41 0 top
JP4  22.5,6.41 0 top
JP5  33.84,6.41 0 top
JP6  51.84,6.41 0 top
JP7  22.54,1.32 0 top
JP8  40.54,1.32 0 top
L1  44.14,9.62 270 bottom
L2  29.31,20.74 90 top
L3  27.95,19.44 90 top
L4  22.54,12.27 90 top
R1  32.92,12.6 180 top
R2  40.96,10.46 180 bottom
R3  32.85,9.26 270 top
R4  53.73,20.84 270 bottom
R5  50.22,20.12 90 bottom
R6  51.37,12.22 180 bottom
R7  41.71,25.17 270 bottom
R8  44.13,22.73 225 bottom
R9  33.53,24.32 90 bottom
R10  13.03,25.04 0 top
R11  49.22,5.93 180 bottom
R12  46.21,5.93 0 bottom
R14  53.73,8.92 270 bottom
R15  53.73,11.92 270 bottom
R17  51.37,14.24 0 bottom
R20  9.58,25.03 0 top
R21  17.33,1.81 270 top
R22  14.93,1.81 270 top
R23  12.53,1.81 270 top
R24  10.13,1.81 270 top
R25  7.73,1.81 270 top
R26  5.33,1.81 270 top
R27  7.92,11.43 180 top
R28  4.92,11.43 0 top
R29  31.4,10.27 90 top
R30  29.57,10.21 270 top
RST  31,24.78 0 top
S1  11.86,31.39 180 top
SJ1  41.27,13.09 270 top
TALRT  16.26,25.66 0 top
TCK  23.9,13.18 0 top
TS1  1.91,1.4 90 top
TS2  1.87,9.05 270 top
TSM  23.14,14.97 0 top
U1  27.55,14.75 270 top
U2  50.67,16.84 0 bottom
U3  13.82,11.91 0 top
U4  48.43,12.41 0 bottom
U$1  29.73,6.96 180 top
U$2  46.66,19.24 270 bottom
U$3  35.18,9.58 90 top
U$4  47.64,9.79 90 bottom
U$5  35.74,13.8 270 top
U$8  35.77,6.2 0 top
U$9  10.52,22.12 90 top
U$10  10.52,18.59 90 top
X2  40.52,18.42 90 bottom
Y1  24.07,21.93 0 top
Y2  33.79,20.57 270 top

### Tracks (layer width: path | path; a pad name or v marks a point on that pad's centre or on a via)
+1V3  (via drill 0.25, 0.33)
  Top 0.152: 36.15,14.3 U$5.1 36.07,14.33
  Top 0.2: U1.26 30.56,13.5 31.65,12.41 31.65,12.01 31.8,11.86 32.32,11.86 32.86,11.32 v32.86,10.95 32.86,10.81 32.85,10.8 R3.1
  Top 0.23: U$5.1 36.04,15.25 35.96,15.33 C8.1 35.78,15.84 35.63,15.99 34.19,15.99 33.65,15.45 v33.65,15.37 | v32.85,10.95 v32.86,10.95
  Top 0.254: +1V3.TP 33.89,14.28 33.89,15.13 v33.65,15.37
  Bottom 0.23: v32.86,10.95 32.86,14.58 v33.65,15.37
+3V3  (via drill 0.25, 0.33)  (2 unrouted)
  Top 0.2: U$8.4 36.12,7.62 v35.97,7.77
  Top 0.254: U$9.8 8.27,18.57 8.29,18.59 | 8.29,18.59 8.29,16.9 U3.1 | U$10.5 8.29,18.59 | U3.1 U3.2 U3.3 8.01,12.89 7.85,12.73 2.69,12.73 0.51,10.55 0.51,7.87 | TS1.2 0.51,5.34 0.51,7.87 | 0.51,7.87 TS2.2 | U3.1 U3.16 16.64,14.53 v17.27,15.16
  Top 0.305: SJ1.1 44.75,14.61 44.76,14.61 45.64,14.61 48.12,17.09 48.12,17.54 48.47,17.89 48.99,17.89 49.58,17.3 49.58,13.31 v49.7,13.19 49.42,13.19 48.79,12.56 48.79,11.45 49.57,10.67 v49.57,8.55
  Top 0.406: FL1.1 23.89,7.56 JP4.2
  Bottom 0.152: U4.1 49.27,12.76
  Bottom 0.2: v35.97,7.77 35.97,6.49 33.96,4.48 33.96,2.89 33.63,2.56 31.91,2.56 31.69,2.34 31.02,2.34 30.76,2.6 24.49,2.6 23.8,3.29 23.8,5.17 JP4.2
  Bottom 0.254: v17.27,15.16 17.97,14.46 21.56,14.46 21.76,14.26 21.76,9.69 JP4.2
  pour Bottom (no thermals): 49.58,8.82 45.9,8.82 45.9,7.94 45.73,7.77 42.53,7.77 42.3,8 42.3,8.9 41.26,8.9 41.26,7.62 41.71,7.17 41.71,5.47 42.14,5.04 44.29,5.04 44.51,5.26 44.51,6.35 44.85,6.69 45.54,6.69 45.93,7.08 47.98,7.08 48.54,6.52 49.05,6.52 49.29,6.76 49.29,8.04 49.61,8.36 49.6,8.36 49.6,8.8
/SYSDISBL  (via drill 0.25)  (1 unrouted)
  Top 0.23: U$1.2 31.36,8.16 33.11,6.41 JP5.1
  Top 0.254: JP6.1 51.84,6.6 50.94,7.5 50.94,10.41 51.53,11 51.53,12.91 51.88,13.26 v52.54,13.26
  Bottom 0.2: 53.45,13.26 53.73,12.98 R15.1 | 53.45,13.26 v52.54,13.26 | 53.45,13.26 53.73,13.54 C9.1
/SYSDISBL_PF  (via drill 0.25)
  Top 0.2: v50.87,11.26 50.7,11.26 v49.56,12.4
  Bottom 0.152: 53.61,11.19 R15.2 | U4.2 v49.55,12.41
  Bottom 0.2: v49.55,12.41 v49.56,12.4 | 53.61,11.19 53.54,11.26 v50.87,11.26
  Bottom 0.305: R14.1 R15.2
ANTENNA
  pour Top (no thermals): 21.84,32.01 21.84,26.13 22.74,26.13 22.74,32.01
  pour Top (no thermals): 21.84,31.51 26.84,31.51 26.84,32.01 21.84,32.01
  pour Top (no thermals): 24.14,31.51 24.14,25.92 24.64,25.92 24.64,31.51
  pour Top (no thermals): 21.84,31.51 26.84,31.51 26.84,32.01 21.84,32.01
  pour Top (no thermals): 26.34,31.51 26.34,28.87 26.84,28.87 26.84,31.51
  pour Top (no thermals): 29.34,31.51 29.34,28.87 28.84,28.87 28.84,31.51
  pour Top (no thermals): 31.54,31.51 31.54,28.87 31.04,28.87 31.04,31.51
  pour Top (no thermals): 26.53,29.37 29.17,29.37 29.17,28.87 26.53,28.87
  pour Top (no thermals): 28.84,32.01 31.54,32.01 31.54,31.51 28.84,31.51
  pour Top (no thermals): 34.04,31.51 34.04,28.87 33.54,28.87 33.54,31.51
  pour Top (no thermals): 31.28,29.37 33.92,29.37 33.92,28.87 31.28,28.87
  pour Top (no thermals): 33.54,32.01 36.24,32.01 36.24,31.51 33.54,31.51
  pour Top (no thermals): 36.24,31.51 36.24,27.57 35.74,27.57 35.74,31.51
B+IN
  pour Bottom (rank 3, no thermals): 50.37,26.7 45.69,26.7 45.69,24.16 50.37,24.16
  pour Top (no thermals): 50.37,26.7 45.69,26.7 45.69,24.16 50.37,24.16
BANDAGE_A_0  (via drill 0.25)  (1 unrouted)
  Top 0.152: U$1.12 29.48,5.42 27.92,3.86 JP7.6
  Top 0.2: v28.69,11.32 28.59,11.42 28.59,11.82 28.29,12.12 U1.22
  Route2 0.2: JP7.6 28.64,4.88 28.64,9.17 29.27,9.8 29.27,10.74 v28.69,11.32
BANDAGE_A_1  (via drill 0.25)  (1 unrouted)
  Top 0.152: v31.43,2.86 31.43,4.53 30.98,4.98 U$1.15
  Route2 0.152: JP7.3 26.38,2.62 31.22,2.62 31.43,2.83 v31.43,2.86
BANDAGE_A_2  (1 unrouted)
  Top 0.152: U$1.14 30.48,4.18 JP7.8
BANDAGE_A_3  (1 unrouted)
  Top 0.152: U$1.13 29.98,5.43 28.89,4.34 28.89,3.05 28.45,2.61 23.83,2.61 JP7.1
BANDAGE_A_4  (via drill 0.25)  (1 unrouted)
  Top 0.152: U$1.1 31.78,7.21 32.26,6.73 v32.26,6.46
  Route2 0.152: v32.26,6.46 33.92,4.8 33.92,2.54 JP7.9
BAT+  (via drill 0.25, 0.33)
  Top 0.2: v52.24,15.29 52.24,17.37 53,18.13 53,18.91 51.65,20.26 48.95,20.26 47.92,21.29 v47.92,21.78
  Bottom 0.152: C6.1 49.21,13.99 48.63,13.41 48.39,13.41 48.09,13.11 U4.6
  Bottom 0.254: U2.P10 52.15,17.66 52.24,17.57 v52.24,15.29 51.97,15.02 51.55,15.02 51.36,14.83 51.36,14.33 51.27,14.24 R17.2
  Bottom 0.305: R17.2 C6.1
  pour Bottom (no thermals): 45.35,26.77 43.43,26.77 42.98,26.32 42.98,24.86 43.48,24.36 43.87,24.36 46.23,22 46.23,20.28 47.04,20.28 47.04,21.22 47.24,21.42 47.82,21.42 48.11,21.71 48.11,23.8 47.51,24.4 46.25,24.4 45.51,25.14 45.51,26.61
BAT-
  pour Bottom (rank 2, no thermals): 49.1,19.82 50.73,19.83 50.74,17.86 49.1,17.87
  pour Bottom (rank 2, no thermals): 54.35,26.73 50.55,26.73 50.55,24.1 48.78,24.1 48.78,22.6 51.61,22.6 51.61,20.11 49.47,20.11 49.47,18.55 50.75,18.55 51.46,19.26 53.03,19.26 53.03,20.92 54.36,20.92
BATDC
  Bottom 0.254: R17.1 52.65,14.67 | U2.P8 50.67,18.27 51.48,19.07 53.75,19.07 53.75,19.13
  Bottom 0.305: R6.2 52.17,12.22 51.63,12.76 51.63,13.72 52.15,14.24 R17.1 | 52.65,14.67 52.92,14.94 52.92,16.88 53.87,17.83 53.87,18.69 53.75,18.81 53.75,19.07 53.75,19.97 R4.2
CONN_STATE_RD  (via drill 0.25, 0.33)
  Top 0.2: U1.23 28.8,12.1 29.27,11.63 v29.32,11.63 | U$1.3 30.48,8.52 30.95,8.99 31.26,8.99 32.53,7.72 v32.63,7.72
  Top 0.23: 30.48,8.02 U$1.3 | 35.48,8.44 34.76,7.72 v32.63,7.72
  Top 0.254: U$3.1 35.48,8.44
  Route2 0.23: 30.76,9.49 32.53,7.72 v32.63,7.72
  Route2 0.254: 30.76,9.49 30.76,10.33 30.54,10.55 29.97,10.55 29.32,11.2 v29.32,11.63
DCDC_SW
  Top 0.2: U1.17 24.1,12.35 23.17,11.42 L4.1
  Top 0.23: U1.17
GND  (via drill 0.25, 0.33, 0.33 pad 0.25, 0.33 pad 0.3)  (3 unrouted)
  Top 0.152: U$5.2 35.44,14.1 U$5.PAD
  Top 0.23: U$1.8 28.03,7.94 28.25,8.16 U$1.7
  Route2 0.406: 17.59,26.42 21.7,26.42 | 21.7,25.55 17.98,25.55 | 17.97,24.84 21.67,24.84 | 17.66,1.21 21.13,1.21 | 17.64,0.51 21.39,0.51 | 17.68,1.99 21.31,1.99
  Route15 0.254: v22.41,16.88 22.41,16.82 21.53,15.94 18.41,15.94 17.93,16.42 v17.93,16.89
  Route15 0.406: 17.6,26.42 21.71,26.42 | 21.7,25.56 17.98,25.56 | 17.97,24.84 21.67,24.84 | 17.68,1.99 21.21,1.99 | 17.84,1.21 21.17,1.21 | 17.81,0.51 21.39,0.51
  Bottom 0.152: U4.3 49.2,12.06 49.37,11.89 v49.37,11.68
  Bottom 0.254: U$2.6 47.38,19.49 v47.15,19.72 | U$2.4 47.41,19.98 v47.15,19.72 | v47.15,19.72 v47.14,19.72 U$2.EXT
  Bottom 0.305: v47.15,18.76 47.27,18.76 47.54,18.49 U$2.8 47.95,18.3 47.95,16.54 C4.2 | U$4.3 U$4.PAD | U$4.9 47.9,9.29 v47.67,9.06
  Bottom 0.406: 17.6,26.42 21.71,26.42 | 21.72,25.56 17.96,25.56 | 17.97,24.84 21.67,24.84
  other vias: 46.17,18.76 46.17,19.72 49.3,20.78 49.3,21.4 49.3,22.02 49.92,22.02 50.54,22.02 51.16,22.02 51.16,21.4 51.16,20.78 41.36,19.71 34.79,14.64 22.4,17.99 35.52,11.98 48.3,16.27 35.5,20.55 34.4,18.09 31.74,15.64 34.48,22.88 35.49,22.85 26.17,16.13 27.09,16.13 28.01,16.13 28.93,16.13 26.17,15.21 27.09,15.21 28.01,15.21 28.93,15.21 26.17,14.29 27.09,14.29 28.01,14.29 28.93,14.29 26.17,13.37 27.09,13.37 28.01,13.37 28.93,13.37 30.3,17.52 30.21,19.95 31.78,22.19 28.04,21.78 27.78,23.95 29.4,24.49 26.82,24.87 24.43,24.87 22.04,24.87 22.57,20.53 35.86,17.49 30.34,21.87 24.15,11.25 28.56,10.23 25.91,20.45 27.01,20.05 31.22,26.22 33.75,26.18 34.95,26.18 27.95,25.94 28.69,25.2 21.86,22.04 24.03,22.4 32.52,18.16 32.05,13.45 27.39,8.15 26.63,9.23 26.68,26.81 22.29,26.59 23.43,26.81 25.58,26.81 27.78,26.81 28.88,26.81 29.98,26.81 31.08,26.81 32.18,26.81 33.28,26.81 34.38,26.81 35.48,26.81 30.24,23.74 29.89,25.76 35.55,26.18 32.52,26.01 53.84,16.83 42.73,24.1 35.96,24.99 34.35,26.18 33.15,26.18 32.52,25.45 32.52,24.88 35.96,25.68 16.13,0.71 13.75,0.71 11.33,0.71 8.95,0.71 6.48,0.71 6.42,10.24 5.89,5.86 8.44,5.85 10.85,5.87 13.21,5.81 15.7,5.79 17.86,5.86 15.85,8.72 13.97,8.73 10.96,8.88 12.39,10.12 13.29,11.58 12.36,13.56 7.44,18.78 7.51,24.16 4.85,25.84 15.04,15.67 12.32,15.67 17.44,18.8 26.41,22.02 26.91,23.06 28.15,21.11 30.15,21.22 30.88,19.61 23.87,21.23 22.89,25.56 47.64,9.77 47.66,10.51 43.54,13.97 50.32,8.98 52.13,9.43 41.81,9.48 41.34,18.64 41.38,17.55 40.8,16.3 39.88,21.03 40.11,24.1 40.11,25.73 30.76,20.52 27.1,21.54
  pour Top (rank 5): -3.83,27.11 76.17,27.11 76.17,-5 -3.83,-5
  pour Bottom (rank 5): -1.33,-2.5 -1.33,27.11 73.67,27.11 73.67,-2.5
  pour Bottom (no thermals): 51.4,22.44 51.42,20.28 48.94,20.28 48.94,22.44
  pour Route2 (rank 5): -2.75,-0.95 -2.75,27.11 38.08,27.11 38.08,-0.73
  pour Route15 (rank 5): -3.32,-0.48 -3.32,27.11 37.51,27.11 37.51,-0.26
  pour Bottom (no thermals): 43.97,20.16 43.97,19.45 43.72,19.45 42.29,19.45 42.29,19.78 42.29,20.15 42.34,20.15
  pour Bottom (no thermals): 41.76,23.16 41.1,23.82 39.66,23.82 39.66,21.21 41.81,21.21 41.81,23.02
  pour Bottom (rank 2, no thermals): 41.52,15.43 39.54,15.43 39.54,13.38 41.62,13.38 41.62,15.39
JACK_PWR
  pour Bottom (no thermals): 45.52,18.57 44.32,18.57 44.19,18.39 44.19,17.53 43.93,17.25 42.23,17.24 41.78,16.82 41.78,13.51 41.21,12.94 41.21,11.94 42.13,11.94 42.58,12.39 42.58,16.05 42.83,16.3 44.26,16.3 45.52,17.56
JTAG_TCKC  (via drill 0.25)
  Top 0.2: U1.14 24.61,14 24.52,14.1 v24.12,14.49
  Top 0.23: TCK.TP 23.9,13.48 24.52,14.1
  Route2 0.152: 23.41,15.2 22.77,15.84 22.77,16.28 22.99,16.5 22.99,19.2 23.66,19.87 23.66,20.17 24.86,21.37
  Route2 0.254: 24.09,14.46 v24.12,14.49 23.41,15.2 19.32,15.2 19,15.52 18.34,15.52 17.89,15.07 17.89,14.88 17.47,14.46 4.57,14.46 JP1.1
JTAG_TSMC  (via drill 0.25)
  Top 0.2: U1.13 | U1.13 24.84,14.5 v23.45,15.89
  Top 0.23: TSM.TP 23.14,15.58 v23.45,15.89
  Route2 0.152: v23.45,15.89 23.45,19.15 24.08,19.78 24.08,19.9 25.21,21.03 26.11,21.03 26.39,20.75 27.78,20.75 27.98,20.55
  Route15 0.254: v17.39,16.51 17.22,16.34 8.03,16.34 5.18,19.19 JP1.5 | 23.4,15.94 v23.45,15.89
  Bottom 0.254: v17.39,16.51 17.96,15.94 23.4,15.94 v23.45,15.89
MCU_RST  (via drill 0.25)
  Top 0.23: 26.7,11.21 v26.72,11.19 26.8,11.27 U1.19
  Route2 0.254: v8.81,15.1 16.28,15.1 17.12,15.94 21.53,15.94 21.74,16.15 21.74,21.33 v21.79,21.38
  Route15 0.23: v34.31,23.72 31.88,23.72 30.69,22.53 26.17,22.53 25.51,21.87
  Route15 0.254: v8.81,15.1 7.74,15.1 5.03,17.81 3.06,17.81 JP1.6 | 31.88,23.72 31.88,23.9 RST.TP | 25.51,21.87 25.42,21.78 22.58,21.78 22.28,21.48 21.89,21.48 v21.79,21.38 21.7,21.29 21.7,19.65 23.86,17.49 23.86,16.58 24.68,15.76 24.68,12.98 26.47,11.19 v26.72,11.19
  Bottom 0.23: C15.1 34.47,23.67 | 34.36,23.67 33.73,23.67 R9.1 | 34.46,23.68 34.47,23.67 | 34.47,23.67 34.36,23.67 | 34.36,23.67 v34.31,23.72
  other vias: 31,24.78
MP_EN_SW  (via drill 0.25, 0.33)
  Top 0.23: U1.6 26.8,17.59 24.78,19.61 v24.54,19.61 | U1.6 | v34.57,11.2 34.92,11.55 34.92,12.25 35.43,12.76 35.8,12.76 36.1,12.46 36.1,9.59
  Top 0.254: U$3.2 35.84,9.33 36.1,9.59
  Route2 0.23: v24.54,19.61 26.77,19.61 34.57,11.81 v34.57,11.2
MPSW  (via drill 0.25, 0.33)
  Top 0.127: v24.08,18.95 24.3,18.73 24.3,17.83 24.61,17.53 24.61,16.11 24.72,16 U1.10
  Top 0.2: U$3.5 34.44,10.33 v34.06,10.71
  Route15 0.2: v24.08,18.95 24.08,18.02 24.69,17.41 24.69,16.46 25.34,15.81 25.34,12.88 25.53,12.69 30.8,12.69 32.33,11.16 32.33,10.73 32.64,10.42 33.12,10.42 33.41,10.71 v34.06,10.71
MSW_0  (via drill 0.25)
  Top 0.2: v26.45,6.12 26.45,5.43 26.76,5.12 28.7,5.12 28.97,5.39 U$1.11
  Top 0.23: U1.7 26.3,17.52 25.06,18.76 v24.82,18.76
  Route2 0.2: 24.75,18.76 24.15,18.16 24.15,15.35 24.61,14.89 24.61,12.69 24.13,12.21 22.8,12.21 22.39,11.8 | 24.23,8.87 24.23,8.34 24.92,7.65 24.93,7.65 24.94,7.64 25.51,7.64 25.52,7.65 26.26,6.91 26.26,6.31 v26.45,6.12
  Route2 0.23: v24.82,18.76 24.75,18.76
  Route2 0.254: 22.39,11.8 22.39,10.71 24.23,8.87
MSW_1  (via drill 0.25)
  Top 0.2: v26.92,6.53 26.92,6.35 27.51,5.76 U$1.10
  Top 0.23: U1.8 25.8,17.46 25.26,18 v24.91,18
  Route2 0.2: 24.56,17.65 24.56,15.61 24.95,15.22 24.95,9.43 26.09,8.29 26.09,7.6 26.62,7.07 26.62,6.83 v26.92,6.53
  Route2 0.23: v24.91,18 24.68,17.77
  Route2 0.254: 24.68,17.77 24.56,17.65
MSW_2  (via drill 0.25, 0.33)
  Top 0.23: U1.9 25.15,17.03 v25.23,17.11 | 27.62,6.71 27.58,6.71 v27.1,7.19
  Top 0.254: 27.62,6.71 U$1.9
  Route2 0.254: v25.23,17.11 25.36,16.98 25.36,9.68 26.59,8.45 26.59,7.7 v27.1,7.19
N$5
  pour Bottom (rank 2, no thermals): 46.76,10.1 42.72,10.1 42.72,11.17 45.59,11.17 45.59,10.35 46.76,10.35
N$6
  Top 0.254: D2.A 6.25,28.64 S1.3
N$7
  Top 0.254: U3.9 16.64,8.95 17.33,8.26 D3.A
N$8
  pour Bottom (rank 2, no thermals): 46.75,9.33 42.68,9.33 42.68,8.08 45.57,8.08 45.57,8.92 45.73,9.21 46.77,9.21 46.76,9.32
N$10
  Bottom 0.23: U$4.6 U$4.7 U$4.8
  pour Bottom (no thermals): 50.57,10.92 48.54,10.92 48.54,9.69 50.57,9.69
N$11
  Top 0.254: U3.5 8.93,11.59 R27.1 8.57,11.23 C25.1 8.57,9.33 8.34,9.1 4.65,9.1 3.77,8.22 3.77,3.26 TS1.1
N$13
  Top 0.254: U3.10 15.52,10.29 14.95,9.72 14.95,7.4 D4.A
N$14
  cutout Route2: 20.98,24.16 18.79,24.16 18.79,22.2 18.79,16.65 19.59,16.65 20.98,16.65
  cutout Bottom: 20.97,24.18 18.78,24.18 18.78,22.22 18.78,16.67 19.58,16.67 20.97,16.67
  cutout Top: 20.98,24.16 18.79,24.16 18.79,22.2 18.79,16.65 19.59,16.65 20.98,16.65
  cutout Route15: 20.98,24.16 18.79,24.16 18.79,22.2 18.79,16.65 19.59,16.65 20.98,16.65
N$15
  Top 0.254: U3.11 15.23,10.94 12.52,8.23 D5.A
N$16
  Top 0.254: D2.C 2.83,28.15 4.48,26.5 5.1,26.5 6.57,25.03 R20.1
N$17
  Top 0.254: U3.12 14.82,11.59 11.5,8.27 10.19,8.27 10.13,8.21 D6.A
N$18
  Top 0.23: Y1.1 | 24.79,20.18 24.78,20.18 | Y1.1 22.86,21.2 23.39,20.68 24.28,20.68 24.78,20.18 | Y1.1 23.21,22.27 C23.1 | U1.5 | U1.5 27.3,17.66 24.78,20.18
N$19
  Top 0.23: U1.4 27.8,17.71 25.26,20.25 Y1.2 24.92,22.27 C24.1
N$20
  Bottom 0.254: R8.2 45.28,21.58 45.72,21.58 45.91,21.39 U$2.1
N$23
  Bottom 0.254: R2.2 41.81,10.98 42.81,11.98 42.81,15.68 43.07,15.94 44.42,15.94 45.43,16.95 45.69,16.95 45.91,17.17 U$2.12
N$24
  Bottom 0.254: R7.2 41.71,23.72 45.19,20.25 U$2.16
N$25
  cutout Route2: 20.97,13.76 18.75,13.76 18.75,2.69 20.97,2.69
  cutout Bottom: 20.97,13.76 18.75,13.76 18.75,2.69 20.97,2.69
  cutout Top: 20.97,13.76 18.75,13.76 18.75,2.69 20.97,2.69
  cutout Route2: 20.97,13.76 18.75,13.76 18.75,2.69 20.97,2.69
  cutout Route15: 20.97,13.76 18.75,13.76 18.75,2.69 20.97,2.69
N$26  (via drill 0.33)
  Top 0.2: SJ1.2 40.43,13.09 39.94,13.58 39.94,15.12 40.54,15.72 45.72,15.72 47.33,17.33 47.33,17.79 48.95,19.41 51.34,19.41 52.04,18.71 v52.04,18.52
  Bottom 0.2: U2.P9 51.16,17.68 51.16,18.18 51.5,18.52 v52.04,18.52
N$27
  Top 0.254: D1.C 4.22,30.45 4.7,29.97 4.7,27.25 4.89,27.06 10.91,27.06 12.18,25.79 R10.1
N$28
  Top 0.254: D8.A 5.33,8.24 5.68,8.59 8.54,8.59 9.26,9.31 9.26,10.33 9.87,10.94 U3.6
N$29
  Top 0.254: U3.7 10,10.29 9.76,10.05 9.76,9.09 8.05,7.38 D7.A
N$30
  Top 0.254: D3.C R21.1
N$31
  Top 0.254: D4.C R22.1
N$32
  Top 0.254: D5.C R23.1
N$33
  Top 0.254: D6.C R24.1
N$34
  Top 0.254: D7.C R25.1
N$35
  Top 0.254: D8.C R26.1
N$36
  Top 0.254: U3.4 4.23,12.24 4.07,12.08 R28.1 4.07,10.1 C26.1 2.72,9.9 TS2.1
N$41
  Top 0.342: L2.2 C12.1 29.31,23.73 27.12,25.92 C13.1
N$43
  Top 0.2: U1.12 24.81,15 24.01,15.8 24.01,16.12 23.7,16.43 C14.1
  Top 0.23: 23.5,16.71 C14.1 23.92,16.69
PERIPHERAL_DETECT  (via drill 0.25)  (1 unrouted)
  Top 0.152: U$1.5 v29.48,8.8 v29.49,8.81
  Route15 0.152: JP7.12 34.54,3.86 32.88,5.52 32.25,5.52 31.07,6.7 31.07,7.23 v29.49,8.81
PERIPHERAL_PWR  (via drill 0.25)
  Top 0.2: v35.24,7.39 35.45,7.39 35.77,7.07 U$8.5 | U1.24 30.14,12.35 v30.29,12.2
  Route2 0.2: 33.68,7.72 33.37,7.72 31.14,9.95 31.14,10.5 30.63,11.01 30.63,11.86 v30.29,12.2
  Route2 0.23: v35.24,7.39 34.51,7.39 34.18,7.72 33.68,7.72
PERIPHERAL_VCC  (via drill 0.25, 0.33)  (1 unrouted)
  Top 0.152: U$5.4 36.04,13.22 35.92,13.1 35.58,13.1 35.44,13.24 U$5.3 | R1.1 33.84,12.6
  Top 0.2: JP7.10 32.7,3.99 33.85,5.14 35.87,5.14 36.12,5.39 U$8.3
  Top 0.23: U$5.3 35.34,13.4 v34.64,13.4 | 34.88,8.43 34.74,8.29 v34.01,8.29
  Top 0.254: U$3.8 34.88,8.43 | 33.84,12.6 34.18,12.6 34.64,13.06 v34.64,13.4 | U$1.16 31.43,6.45 31.97,5.91 31.97,4.59 JP7.10 JP7.11
  Top 0.305: SJ1.3 41.29,11.55 43.7,11.55 44.24,12.09 44.24,13 44.99,13.75 45.57,13.75 45.95,13.37 v45.95,6.83
  Bottom 0.2: C27.1 35.57,13.4 v34.64,13.4
  Bottom 0.23: v34.64,13.4 34.64,12.06 35.23,11.47 35.23,9.51 v34.01,8.29
  Bottom 0.305: v34.01,8.29 33.98,8.26 33.84,8.4 31.17,8.4 U$1.PAD 32.7,3.99 JP7.10 | R12.2 45.36,6.24 v45.95,6.83 49.85,6.83 50.07,6.61 R11.2 50.07,4.49 JP8.10 JP8.11
  other vias: 29.73,6.96
PROG_VCC
  Top 0.254: JP1.7 2.91,23.04 2.91,25.07 1.77,26.21 1.77,31.3 2.11,31.64 4.6,31.64 D1.A 5.88,30.36 11.65,30.36 11.86,30.15 S1.2
RF_N
  Top 0.23: U1.2 28.8,17.94 L3.1
RF_P
  Top 0.23: U1.1 C11.1 | L3.2 L2.1
  Top 0.342: C11.1 L2.1
SCL  (via drill 0.25, 0.33)  (1 unrouted)
  Top 0.2: U1.20 27.3,11.78 v27.31,11.78 v27.32,11.77
  Top 0.254: U$9.2 13.59,21.8 13.82,21.56 | 13.82,21.56 13.82,18.22 12.44,16.84 11.52,16.84 | U$10.6 9.17,17.04 9.38,16.84 11.52,16.84 | 11.59,16.77 11.52,16.84 | 13.82,21.56 15.2,20.18 JP2.2 | v14.81,12.89 U3.14
  Top 0.305: v48.57,5.92 48.99,6.34 48.99,10.62 48.32,11.29 48.32,13.99 49.13,14.8 49.13,16.88 v48.7,17.31
  Route2 0.2: v27.32,11.77 27.32,9.4 27.88,8.84 27.88,6.8 26.16,5.08 23.76,5.08 JP7.2
  Route15 0.254: v14.81,12.89 15.89,12.89 17.89,14.89 17.89,15.07 18.34,15.52 19,15.52 19.32,15.2 22.66,15.2 24.21,13.65 24.21,12.71 26.3,10.62 27.11,10.62 27.32,10.83 v27.32,11.77 27.32,11.52
  Bottom 0.152: v48.7,17.31 49.32,16.69 50.55,16.69 50.67,16.57 U2.P3
  Bottom 0.254: JP2.2 14.31,18.73 14.31,14.71 14.73,14.29 14.73,12.97 v14.81,12.89
  Bottom 0.305: R11.1 v48.57,5.92 48.57,5.56 48.56,5.56 48.11,5.11 47.38,5.11 47.38,5.1 46.9,4.62 46.9,3.02 46.45,2.57 41.83,2.57 JP8.2
SDA  (via drill 0.25, 0.33)  (1 unrouted)
  Top 0.23: U1.21 27.8,12.14 27.88,12.06 27.88,11.89 27.95,11.82 27.95,11.77 v28.04,11.68
  Top 0.254: U$10.1 12.44,17.59 13.09,18.24 v13.09,19.79 12.77,20.11 U$9.1 | v17.83,13.64 17.74,13.55 16.63,13.55 U3.15 14.07,13.54 v14.06,13.55
  Top 0.305: R12.1 48.25,7.12 48.25,10.73 47.81,11.17 47.81,14.61 v48.35,15.15
  Route2 0.23: 26.42,4.65 28.25,6.48 28.25,9.1 27.96,9.39 27.96,11.6 v28.04,11.68
  Route2 0.254: 26.42,4.65 25.88,4.65 JP7.4
  Route15 0.254: v17.83,13.64 17.83,14.05 18.24,14.46 21.57,14.46 21.77,14.26 21.77,11.86 24.99,8.64 26.9,8.64 27.96,9.7 27.96,11.6 v28.04,11.68
  Bottom 0.2: U2.P2 51.17,15.36 50.81,15 48.5,15 v48.35,15.15
  Bottom 0.254: JP2.3 13.09,20.05 v13.09,19.79 13.09,14.52 v14.06,13.55
  Bottom 0.305: R12.1 47.06,5.77 46.41,5.12 44.58,5.12 43.32,3.86 JP8.4
  other vias: 47.06,5.93
SYSOFF  (via drill 0.33)
  Top 0.305: R6.1 50.28,12.46 50.28,15.95 52.62,18.29 52.62,18.75 51.52,19.85 48.81,19.85 47.46,21.2 v42.67,21.2
  Bottom 0.152: R6.1 50.52,11.99 49.69,11.16 49.12,11.16 48.56,11.72 48.21,11.72 48.1,11.83 U4.4
  Bottom 0.254: U$2.15 44.54,19.49 44.28,19.75 44.28,20.32 43.4,21.2 v42.67,21.2
  Bottom 0.305: 50.75,12.22 R6.1
  other vias: 50.52,12.22
TALRT
  Top 0.254: U$9.3 13.72,22.45 16.26,24.99 TALRT.TP
V_PREBUCK  (via drill 0.25, 0.33)  (1 unrouted)
  Top 0.2: v31.62,10.92 R29.2 | v49.02,18.73 48.77,18.73 47.67,17.63 47.67,17.19 45.68,15.2 v44.42,15.2
  Top 0.254: v17.64,17.59 18.07,18.02 18.07,26.99 16.42,28.64 S1.1
  Top 0.305: v45.27,13.15 45.27,11.63 44.07,10.43 41.02,10.43 40.5,9.91 JP3.1
  Route2 0.254: v18.66,14.98 19.18,14.46 21.57,14.46 21.77,14.26 21.77,7.14 JP4.1
  Route15 0.152: v31.62,10.92 30.87,10.92 28.34,8.39 28.34,7.93 28.08,7.67 23.76,7.67 JP4.1
  Bottom 0.254: U$2.5 48.15,19.98 48.53,19.98 49.02,19.49 v49.02,18.73 | v17.64,17.59 v17.63,17.59 16.75,16.71 16.75,16.11 17.03,15.83 17.38,15.83 18.23,14.98 v18.66,14.98
  Bottom 0.305: v44.42,15.2 44.91,15.2
  pour Bottom (no thermals): 46.96,18.12 46.32,18.12 46.32,17.13 44.7,15.51 44.7,11.63 45.72,11.63 46.1,11.25 46.1,10.7 46.86,10.7 46.86,14.93 47.39,15.46 47.39,16.97 46.96,17.4
V_PREBUCK_DIV2
  Top 0.152: U$1.4 29.98,8.53 30.7,9.25 30.7,9.7
  Top 0.2: R29.1 31.32,9.7 30.7,9.7 29.71,9.7 R30.2
VCC  (via drill 0.25)
  Top 0.127: 23.79,17.86 23.79,17.89 C16.1
  Top 0.152: U1.11 24.79,15.5 24.33,15.96 24.33,17.41 23.86,17.88 23.81,17.88 23.79,17.86
  Top 0.2: 21.64,15.19 21.65,15.19 21.67,15.21 | 21.67,12.78 21.67,10.46 | C19.1 21.89,10.24 21.67,10.46 | 21.67,10.46 21.67,8.31 22.18,8.31 | U1.18
  Top 0.23: 31.56,14.5 C17.1 31.62,14.43 | C16.1 23.7,18.42 23.42,18.7 21.9,18.7 | 21.67,12.78 21.67,14.76 21.67,15.21 21.67,18.47 21.9,18.7 | 21.9,18.7 C18.1 | 31.55,14.5 31.62,14.43 | U1.28 31.01,14.5 v31.08,14.43 31.62,14.43 | 22.33,8.83 22.33,8.8 FL1.2 | 21.68,14.75 21.78,14.65 v22.15,14.65
  Top 0.254: JP2.1 15.76,16.97 16.89,15.84 19.44,15.84 20.09,15.19 21.64,15.19 | 21.68,14.75 21.67,14.76
  Top 0.305: U1.18 26.3,11.79 24.45,9.94 24.45,9.69 24.24,9.48 22.33,9.48 | 22.33,9.48 22.33,10.18 C19.1 | 22.33,8.83 22.33,9.48
  Route15 0.23: R9.2 34.07,25.17 36.09,23.15 36.09,22.36 33.5,19.77 32.69,19.77 31.13,18.21 31.13,14.48 v31.08,14.43
  Bottom 0.23: v31.08,14.43 29.32,12.67 23.54,12.67 23.16,13.05 23.16,14.14 22.65,14.65 v22.15,14.65
  Bottom 0.254: JP2.1 15.76,12.34 14.17,10.75 2.51,10.75 0.52,12.74 0.52,15.49 JP1.4
  other vias: 33.53,25.17
VDDR  (via drill 0.25)
  Top 0.23: U1.32 30.42,16.5 31.63,17.71 31.63,21.39 30.9,22.12 30.9,22.49 C21.1 31.63,23.22 31.63,23.69 32.27,24.33 35.87,24.33 36.12,24.08 36.12,18.67 34.07,16.62 | 33.95,16.5 32.49,15.04 v32.43,15.04 32.39,15 U1.29 | 33.89,16.53 C22.1 33.92,16.5 33.95,16.5 | C20.1 34.07,16.62 | 34.07,16.62 33.95,16.5
  Top 0.305: L4.2 22.54,13.82 v22.44,13.92
  Bottom 0.23: 32.45,15.02 v32.43,15.04 32.43,15.02 30.08,12.67 29.89,12.67 29.49,12.27 22.64,12.27 22.44,12.47 v22.44,13.92
VSENSE_0  (via drill 0.33)
  Top 0.2: U1.27 30.66,14 32.06,12.6 R1.2 32.27,12.43 33.53,11.17 33.53,10.45 33.89,10.09 v33.89,9.92
  Top 0.254: U$3.6 33.98,9.83 v33.89,9.92
VSENSE_1  (via drill 0.33)
  Top 0.2: U1.25 30.52,13 31.04,12.48 31.04,11.94 31.06,11.94 31.47,11.53 31.98,11.53 31.98,11.5 32.14,11.34 32.14,8.93 32.46,8.61 R3.2 33.31,8.61 33.32,8.6
  Top 0.23: v33.79,9.07 33.32,8.6
  Top 0.254: U$3.7 34.48,9.33 34.22,9.07 v33.79,9.07
X24M_N
  Top 0.127: 34.59,19.35 Y2.3
  Top 0.152: U1.30 30.74,15.5 34.59,19.35
X24M_P
  Top 0.152: U1.31 30.8,16 31.98,17.18 31.98,20.66 Y2.1

### Text on the board
Dimension: CUT OUT | CUT OUT
tPlace: Debug Attachment Board | TOP | BOTTOM
tNames: SDA | SCL | VCC | LEDS Require Own Ground
tDocu: Note: The distance from the top of the antenna to / the board edge is increased due to the / trace-dimension clearance of 15mil (0.381mm)